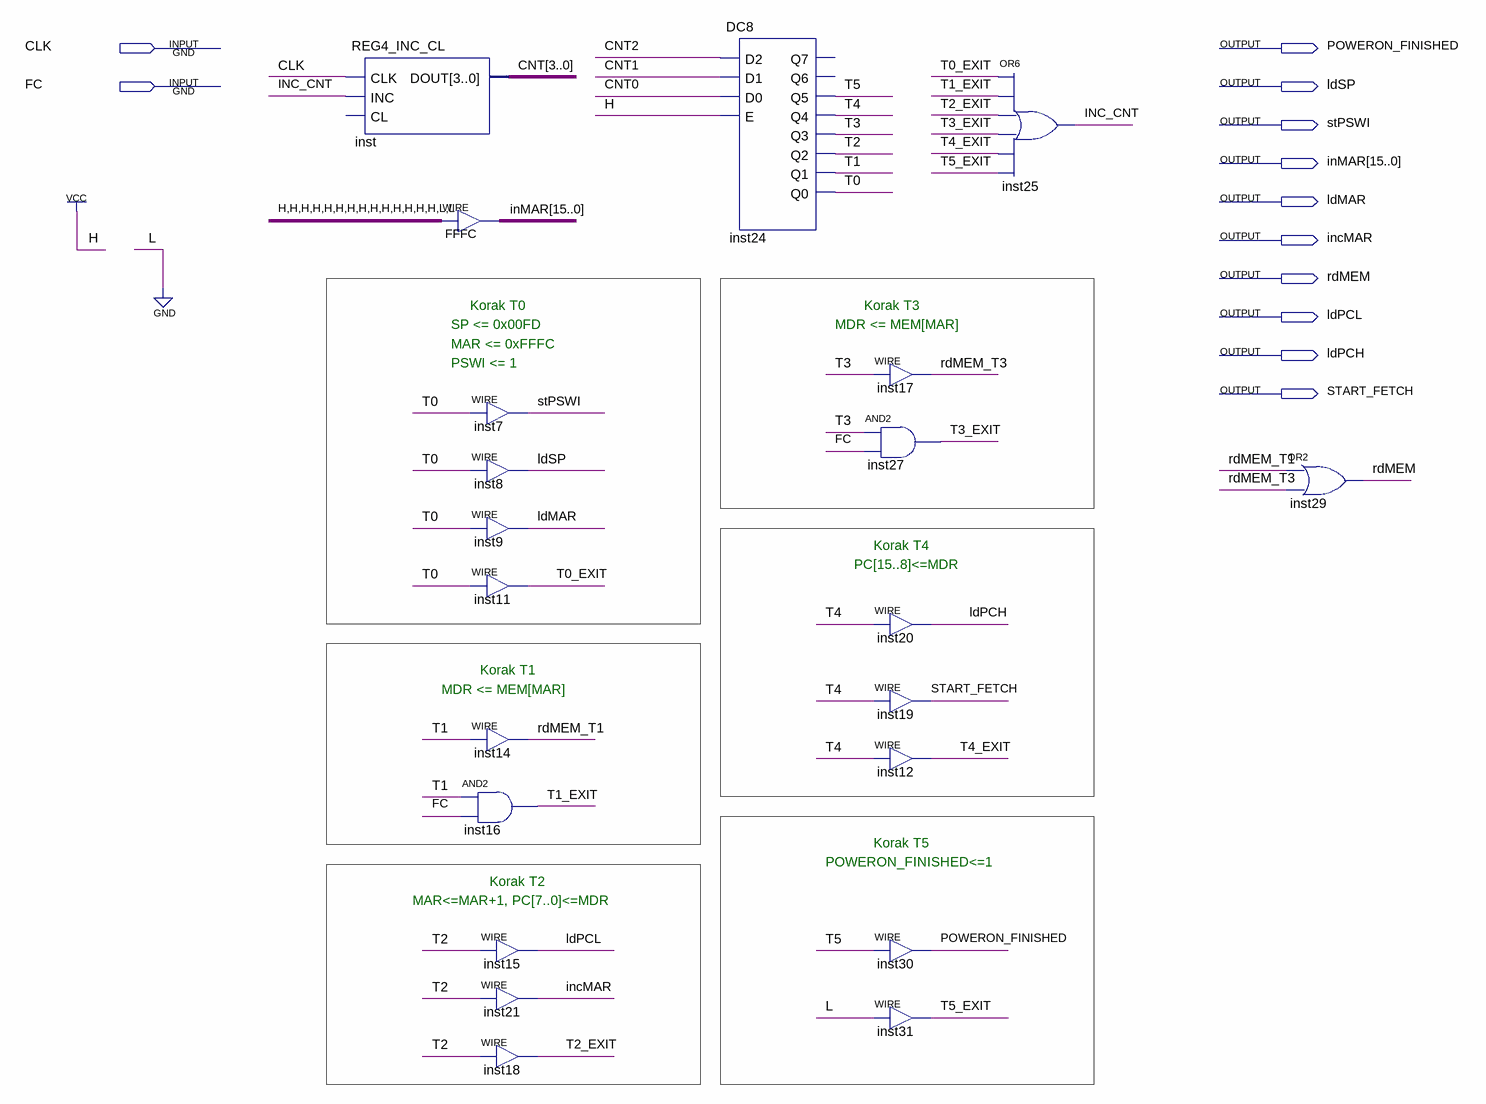
[diagram p0: schematic sheet]
// Quartus schematic cpu_poweron.bdf as structural Verilog: 21 symbols, 12 pins
module cpu_poweron (
  input  CLK,
  input  FC,
  output POWERON_FINISHED,
  output ldSP,
  output stPSWI,
  output [15:0] inMAR,
  output ldMAR,
  output incMAR,
  output rdMEM,
  output ldPCL,
  output ldPCH,
  output START_FETCH
);

  wire INC_CNT, rdMEM_T1, rdMEM_T3, T0, T0_EXIT, T1, T1_EXIT, T2, T2_EXIT, T3, T3_EXIT, T4, T4_EXIT, T5,
       T5_EXIT;
  wire [3:0] CNT;

  REG4_INC_CL inst (.CLK(CLK), .INC(INC_CNT), .DOUT(CNT));  // open: CL
  assign inMAR = 16'b1111111111111100;  // WIRE FFFC
  assign stPSWI = T0;  // WIRE inst7
  assign ldSP = T0;  // WIRE inst8
  assign ldMAR = T0;  // WIRE inst9
  assign T0_EXIT = T0;  // WIRE inst11
  assign rdMEM_T1 = T1;  // WIRE inst14
  and inst16 (T1_EXIT, T1, FC);
  assign ldPCL = T2;  // WIRE inst15
  assign incMAR = T2;  // WIRE inst21
  assign T2_EXIT = T2;  // WIRE inst18
  DC8 inst24 (
    .D2(CNT[2]), .D1(CNT[1]), .D0(CNT[0]), .E(1'b1), .Q5(T5), .Q4(T4), .Q3(T3), .Q2(T2), .Q1(T1), .Q0(T0));  // open: Q7, Q6
  assign rdMEM_T3 = T3;  // WIRE inst17
  and inst27 (T3_EXIT, T3, FC);
  assign ldPCH = T4;  // WIRE inst20
  assign START_FETCH = T4;  // WIRE inst19
  assign T4_EXIT = T4;  // WIRE inst12
  assign POWERON_FINISHED = T5;  // WIRE inst30
  assign T5_EXIT = 1'b0;  // WIRE inst31
  or inst25 (INC_CNT, T0_EXIT, T1_EXIT, T2_EXIT, T3_EXIT, T4_EXIT, T5_EXIT);
  or inst29 (rdMEM, rdMEM_T1, rdMEM_T3);

  // Notes on the sheet:
  //   Korak T0
  //   Korak T3
  //   SP <= 0x00FD
  //   MDR <= MEM[MAR]
  //   MAR <= 0xFFFC
  //   PSWI <= 1
  //   Korak T4
  //   PC[15..8]<=MDR
  //   Korak T1
  //   MDR <= MEM[MAR]
  //   Korak T5
  //   POWERON_FINISHED<=1
  //   Korak T2
  //   MAR<=MAR+1, PC[7..0]<=MDR
endmodule
